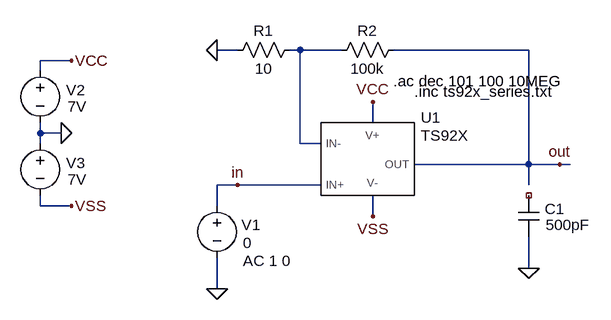
[diagram p0: schematic TS922_AC.asc]
TS922_AC.asc, the LTspice schematic file:
Version 4
SHEET 1 880 680
WIRE 32 32 0 32
WIRE 128 32 112 32
WIRE 192 32 128 32
WIRE 480 32 272 32
WIRE -224 48 -272 48
WIRE -272 64 -272 48
WIRE 240 144 240 112
WIRE -272 160 -272 144
WIRE -240 160 -272 160
WIRE -272 176 -272 160
WIRE 128 176 128 32
WIRE 160 176 128 176
WIRE 480 208 480 32
WIRE 480 208 304 208
WIRE 528 208 480 208
WIRE 544 208 528 208
WIRE 32 240 0 240
WIRE 160 240 32 240
WIRE 480 240 480 208
WIRE -272 272 -272 256
WIRE -224 272 -272 272
WIRE 0 272 0 240
WIRE 240 288 240 256
WIRE 480 368 480 320
WIRE 0 400 0 352
FLAG 240 112 VCC
FLAG 240 288 VSS
FLAG 528 208 out
FLAG 0 400 0
FLAG 480 368 0
FLAG -224 48 VCC
FLAG -224 272 VSS
FLAG -240 160 0
FLAG 32 240 in
FLAG 0 32 0
SYMBOL res 128 16 R90
WINDOW 0 2 56 VBottom 2
WINDOW 3 29 56 VTop 2
SYMATTR InstName R1
SYMATTR Value 10
SYMBOL res 288 16 R90
WINDOW 0 2 56 VBottom 2
WINDOW 3 29 56 VTop 2
SYMATTR InstName R2
SYMATTR Value 100k
SYMBOL voltage 0 256 R0
WINDOW 0 38 45 Left 2
WINDOW 3 40 73 Left 2
WINDOW 123 40 101 Left 2
WINDOW 39 0 0 Left 2
SYMATTR InstName V1
SYMATTR Value 0
SYMATTR Value2 AC 1 0
SYMBOL voltage -272 48 R0
WINDOW 0 40 46 Left 2
WINDOW 3 42 71 Left 2
SYMATTR InstName V2
SYMATTR Value 7V
SYMBOL voltage -272 160 R0
WINDOW 0 40 46 Left 2
WINDOW 3 42 71 Left 2
SYMATTR InstName V3
SYMATTR Value 7V
SYMBOL TS922 160 176 R0
SYMATTR InstName U1
SYMBOL cap 464 256 R0
WINDOW 0 41 21 Left 2
WINDOW 3 42 45 Left 2
SYMATTR InstName C1
SYMATTR Value 500pF
TEXT 304 96 Left 2 !.inc ts92x_series.txt
TEXT 272 80 Left 2 !.ac dec 101 100 10MEG

The netlist it stands for:
* TS922_AC.asc
R1 N001 0 10
R2 out N001 100k
V1 in 0 0 AC 1 0
V2 VCC 0 7V
V3 0 VSS 7V
XU1 N001 in out VCC VSS TS92X  ; pins IN- IN+ OUT V+ V-
C1 NC_01 0 500pF
.inc ts92x_series.txt
.ac dec 101 100 10MEG
.backanno
.end